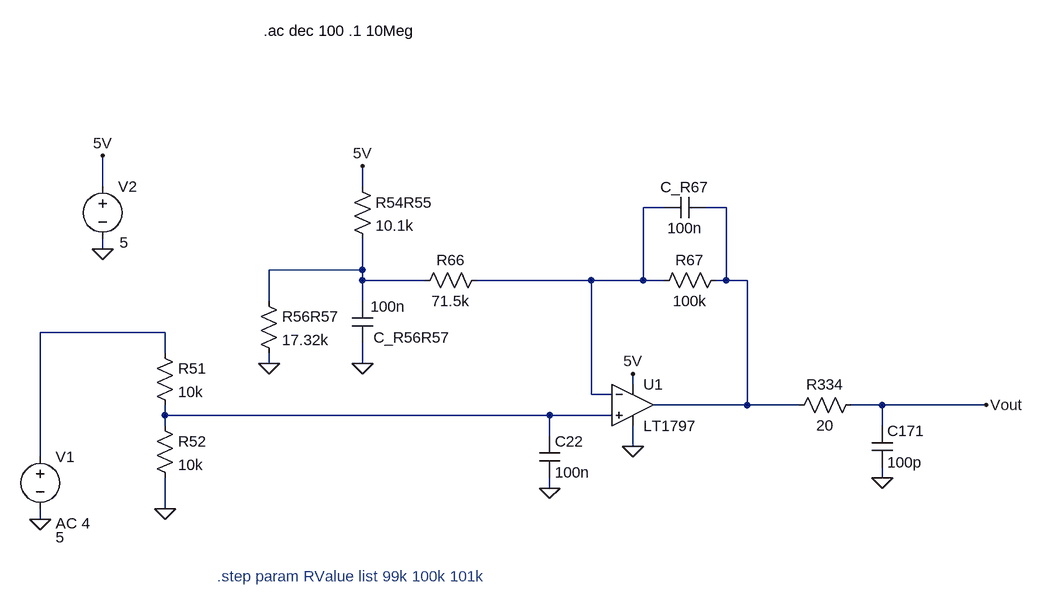
[diagram p0: schematic OEM Current Sensor Reconfigured Unipolar - AC Analysis.asc]
OEM Current Sensor Reconfigured Unipolar - AC Analysis.asc, the LTspice schematic file:
Version 4
SHEET 1 1796 924
WIRE 368 128 368 80
WIRE 768 128 768 96
WIRE 1232 160 1200 160
WIRE 1328 160 1296 160
WIRE 368 224 368 208
WIRE 768 256 768 208
WIRE 768 256 624 256
WIRE 768 272 768 256
WIRE 864 272 768 272
WIRE 1120 272 944 272
WIRE 1200 272 1200 160
WIRE 1200 272 1120 272
WIRE 1232 272 1200 272
WIRE 1328 272 1328 160
WIRE 1328 272 1312 272
WIRE 1360 272 1328 272
WIRE 624 304 624 256
WIRE 768 304 768 272
WIRE 464 352 272 352
WIRE 464 384 464 352
WIRE 624 400 624 384
WIRE 768 400 768 368
WIRE 1184 432 1184 416
WIRE 1120 448 1120 272
WIRE 1152 448 1120 448
WIRE 1360 464 1360 272
WIRE 1360 464 1216 464
WIRE 1440 464 1360 464
WIRE 1568 464 1520 464
WIRE 1728 464 1568 464
WIRE 464 480 464 464
WIRE 1056 480 464 480
WIRE 1152 480 1056 480
WIRE 464 496 464 480
WIRE 1568 496 1568 464
WIRE 1056 512 1056 480
WIRE 1184 528 1184 496
WIRE 272 544 272 352
WIRE 1568 576 1568 560
WIRE 1056 592 1056 576
WIRE 464 624 464 576
WIRE 272 640 272 624
FLAG 464 624 0
FLAG 768 400 0
FLAG 1184 528 0
FLAG 1184 416 5V
FLAG 768 96 5V
FLAG 1728 464 Vout
FLAG 1056 592 0
FLAG 1568 576 0
FLAG 624 400 0
FLAG 272 640 0
FLAG 368 224 0
FLAG 368 80 5V
SYMBOL voltage 272 528 R0
WINDOW 3 24 140 Left 2
WINDOW 123 24 118 Left 2
SYMATTR Value 5
SYMATTR Value2 AC 4
SYMATTR InstName V1
SYMATTR SpiceLine Rser=0
SYMBOL OpAmps/LT1797 1184 400 R0
SYMATTR InstName U1
SYMBOL res 752 112 R0
SYMATTR InstName R54R55
SYMATTR Value 10.1k
SYMBOL res 608 288 R0
SYMATTR InstName R56R57
SYMATTR Value 17.32k
SYMBOL res 848 288 R270
WINDOW 0 32 56 VTop 2
WINDOW 3 0 56 VBottom 2
SYMATTR InstName R66
SYMATTR Value 71.5k
SYMBOL res 1216 288 R270
WINDOW 0 32 56 VTop 2
WINDOW 3 0 56 VBottom 2
SYMATTR InstName R67
SYMATTR Value 100k
SYMBOL res 1536 448 R90
WINDOW 0 0 56 VBottom 2
WINDOW 3 32 56 VTop 2
SYMATTR InstName R334
SYMATTR Value 20
SYMBOL cap 1552 496 R0
SYMATTR InstName C171
SYMATTR Value 100p
SYMBOL cap 1040 512 R0
SYMATTR InstName C22
SYMATTR Value 100n
SYMBOL cap 752 304 R0
WINDOW 0 33 56 Left 2
WINDOW 3 28 8 Left 2
SYMATTR InstName C_R56R57
SYMATTR Value 100n
SYMBOL res 448 480 R0
SYMATTR InstName R52
SYMATTR Value 10k
SYMBOL res 448 368 R0
SYMATTR InstName R51
SYMATTR Value 10k
SYMBOL voltage 368 112 R0
WINDOW 3 26 102 Left 2
WINDOW 123 24 118 Left 2
SYMATTR Value 5
SYMATTR InstName V2
SYMBOL cap 1296 144 R90
WINDOW 0 0 32 VBottom 2
WINDOW 3 32 32 VTop 2
SYMATTR InstName C_R67
SYMATTR Value 100n
TEXT 544 728 Left 2 ;.step param RValue list 99k 100k 101k
TEXT 616 -112 Left 2 !.ac dec 100 .1 10Meg

The netlist it stands for:
* OEM Current Sensor Reconfigured Unipolar - AC Analysis.asc
V1 N004 0 5 AC 4 Rser=0
XU1 N005 N001 5V 0 N002 LT1797  ; pins In+ In- V+ V- OUT
R54R55 5V N003 10.1k
R56R57 N003 0 17.32k
R66 N003 N001 71.5k
R67 N001 N002 100k
R334 Vout N002 20
C171 Vout 0 100p
C22 N005 0 100n
C_R56R57 N003 0 100n
R52 N005 0 10k
R51 N004 N005 10k
V2 5V 0 5
C_R67 N002 N001 100n
* .step param RValue list 99k 100k 101k
.ac dec 100 .1 10Meg
.backanno
.end